# Altium project mycar_batchargepcb.PrjPcb
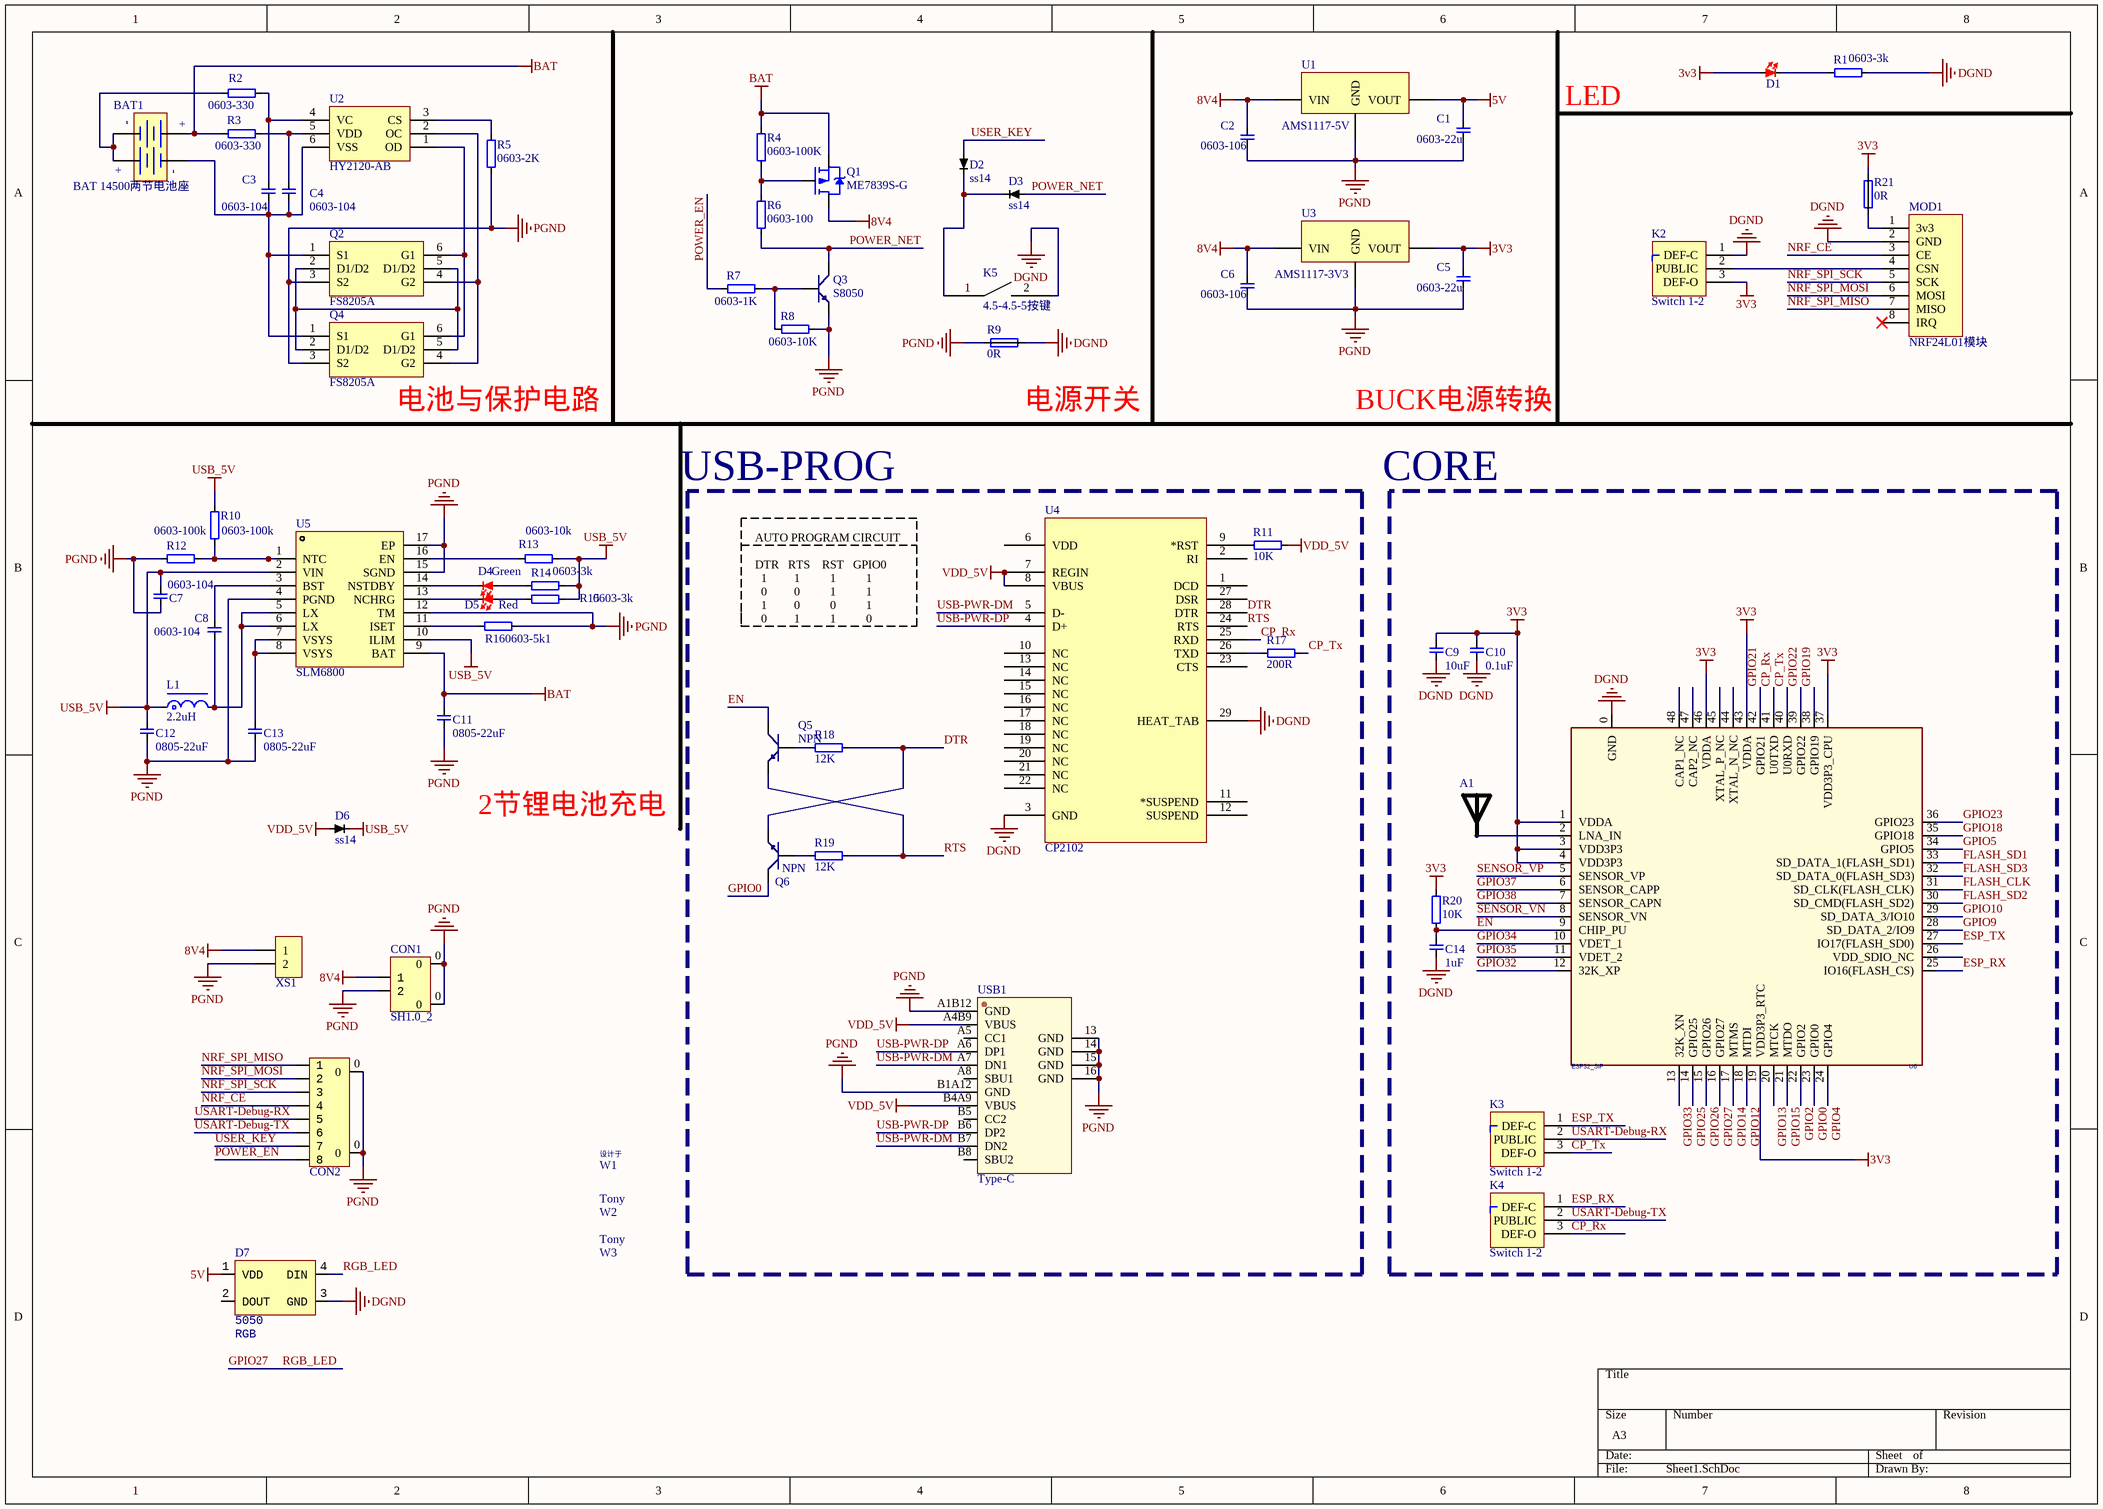
[diagram p0: Sheet1.SchDoc]
1 sheet, 69 parts. Net scope: global (net labels, ports and power ports of the same name join across sheets).
Board file: PCB1.PcbDoc

## Sheet Sheet1.SchDoc
size A3; SheetNumber: 1; SheetTotal: 1

### Parts
A1  RAINSUN  [ANT-Rainsun-AN5120]  (value not drawn)
BAT1  BAT 14500两节电池座  [BAT5#x2 电池座]
C1  0603-22u  [CAP_0603]
C2  0603-106  [CAP_0603]
C3  0603-104  [CAP_0603]
C4  0603-104  [CAP_0603]
C5  0603-22u  [CAP_0603]
C6  0603-106  [CAP_0603]
C7  0603-104  [CAP_0603]
C8  0603-104  [CAP_0603]
C9  10uF  [CAP_0603]
C10  0.1uF  [CAP_0603]
C11  0805-22uF  [CAP_0805]
C12  0805-22uF  [CAP_0805]
C13  0805-22uF  [CAP_0805]
C14  1uF  [CAP_0603]
CON1  SH1.0_2  [SH1.0 Vertical 2P]
CON2  FFC_0.5_8  [FFC_0.5_8]  (value not drawn)
D1  led  [led0603]  (value not drawn)
D2  ss14  [SOD-323]
D3  ss14  [SOD-323]
D4  Green  [led0603]
D5  Red  [led0603]
D6  ss14  [SOD-323]
D7  Type: 5050  [LED_5050_WS2812B]  (hidden comment: RGB)
K2  Switch 1-2  [Switch 1-2 0603]
K3  Switch 1-2  [Switch 1-2 0603]
K4  Switch 1-2  [Switch 1-2 0603]
K5  4.5-4.5-5按键  [4.5-4.5-5按键]
L1  2.2uH  [NR4012]
MOD1  NRF24L01模块  [NRF24L01模块-贴片]
Q1  ME7839S-G  [SOT23]
Q2  FS8205A  [SOT23-6]
Q3  S8050  [SOT23]
Q4  FS8205A  [SOT23-6]
Q5  NPN  [SOT23]
Q6  NPN  [SOT23]
R1  0603-3k  [RES_0603]
R2  0603-330  [RES_0603]
R3  0603-330  [RES_0603]
R4  0603-100K  [RES_0603]
R5  0603-2K  [RES_0603]
R6  0603-100  [RES_0603]
R7  0603-1K  [RES_0603]
R8  0603-10K  [RES_0603]
R9  0R  [RES_0805-SHORT]
R10  0603-100k  [RES_0603]
R11  10K  [RES_0603]
R12  0603-100k  [RES_0603]
R13  0603-10k  [RES_0603]
R14  0603-3k  [RES_0603]
R15  0603-3k  [RES_0603]
R16  0603-5k1  [RES_0603]
R17  200R  [RES_0603]
R18  12K  [RES_0603]
R19  12K  [RES_0603]
R20  10K  [RES_0603]
R21  0R  [RES_0603-SHORT]
U1  AMS1117-5V  [SOT223]
U2  HY2120-AB  [SOT23-6]
U3  AMS1117-3V3  [SOT223]
U4  CP2102  [QFN-28]
U5  SLM6800  [QFN-16_4x4]
U6  ESP32_SIP  [QFN-48_7X7]
USB1  Type-C  [TypeC-304-16BCP]
W1  设计于  [designed by（430-70）]  (value not drawn)
W2  Tony  [Tony_2(200-70)]  (value not drawn)
W3  Tony  [Tony_artist]  (value not drawn)
XS1  HDR-1X2  [15EDGVM-2P]  (value not drawn)

### Nets
3V3: C5.2 C9.2 C10.2 D1.1 K2.3(DEF-O) R20.2 R21.2 U3.2(VOUT) U6.1(VDDA) U6.3(VDD3P3) U6.4(VDD3P3) U6.19(VDD3P3_RTC) U6.37(VDD3P3_CPU) U6.43(VDDA) U6.46(VDDA)
5V: C1.2 D7.1(VDD) U1.2(VOUT)
8V4: C2.2 C6.2 CON1.1 Q1.3(D) U1.3(VIN) U3.3(VIN) XS1.1
BAT: BAT1.3(+) C11.2 Q1.2(S) R3.1 R4.2 U5.9(BAT)
DGND: C9.1 C10.1 C14.1 D7.3(GND) K2.1(DEF-C) K5.2 MOD1.2(GND) R1.2 R9.1 U4.3(GND) U4.29(HEAT_TAB) U6.0(GND)
PGND: C1.1 C2.1 C5.1 C6.1 C7.2 C11.1 C12.1 C13.1 CON1.0 CON1.2 CON2.0 Q2.3(S2) Q3.2(E) Q4.3(S2) R5.1 R8.1 R9.2 R12.2 R16.1 U1.1(GND) U3.1(GND) U5.4(PGND) U5.12(TM) U5.15(SGND) U5.17(EP) USB1.13(GND) USB1.14(GND) USB1.15(GND) USB1.16(GND) USB1.A1B12(GND) USB1.B1A12(GND) XS1.2
USB_5V: C7.1 C12.2 D6.2 L1.1 R10.2 R13.1 R14.1 R15.1 U5.2(VIN) U5.10(ILIM)
VDD_5V: D6.1 R11.1 U4.7(REGIN) U4.8(VBUS) USB1.A4B9(VBUS) USB1.B4A9(VBUS)
CP_Rx: K4.3(DEF-O) U4.25(RXD) U6.41(U0TXD)
CP_Tx: K3.3(DEF-O) R17.1 U6.40(U0RXD)
DTR: Q6.2(E) R18.1 U4.28(DTR)
EN: C14.2 Q5.3(C) R20.1 U6.9(CHIP_PU)
ESP_RX: K4.1(DEF-C) U6.25(IO16(FLASH_CS))
ESP_TX: K3.1(DEF-C) U6.27(IO17(FLASH_SD0))
FLASH_CLK: U6.31(SD_CLK(FLASH_CLK))
FLASH_SD1: U6.33(SD_DATA_1(FLASH_SD1))
FLASH_SD2: U6.30(SD_CMD(FLASH_SD2))
FLASH_SD3: U6.32(SD_DATA_0(FLASH_SD3))
GPIO0: Q6.3(C) U6.23(GPIO0)
GPIO2: U6.22(GPIO2)
GPIO4: U6.24(GPIO4)
GPIO5: U6.34(GPIO5)
GPIO9: U6.28(SD_DATA_2/IO9)
GPIO10: U6.29(SD_DATA_3/IO10)
GPIO12: U6.18(MTDI)
GPIO13: U6.20(MTCK)
GPIO14: U6.17(MTMS)
GPIO15: U6.21(MTDO)
GPIO18: U6.35(GPIO18)
GPIO19: U6.38(GPIO19)
GPIO21: U6.42(GPIO21)
GPIO22: U6.39(GPIO22)
GPIO23: U6.36(GPIO23)
GPIO25: U6.14(GPIO25)
GPIO26: U6.15(GPIO26)
GPIO27: D7.4(DIN) U6.16(GPIO27)  [also labelled RGB_LED]
GPIO32: U6.12(32K_XP)
GPIO33: U6.13(32K_XN)
GPIO34: U6.10(VDET_1)
GPIO35: U6.11(VDET_2)
GPIO37: U6.6(SENSOR_CAPP)
GPIO38: U6.7(SENSOR_CAPN)
NRF_CE: CON2.4 MOD1.3(CE)
NRF_SPI_MISO: CON2.1 MOD1.7(MISO)
NRF_SPI_MOSI: CON2.2 MOD1.6(MOSI)
NRF_SPI_SCK: CON2.3 MOD1.5(SCK)
POWER_EN: CON2.8 R7.2
POWER_NET: D3.1 Q3.3(C) R6.1
RTS: Q5.2(E) R19.1 U4.24(RTS)
SENSOR_VN: U6.8(SENSOR_VN)
SENSOR_VP: U6.5(SENSOR_VP)
USART-Debug-RX: CON2.5 K3.2(PUBLIC)
USART-Debug-TX: CON2.6 K4.2(PUBLIC)
USB-PWR-DM: U4.5(D-) USB1.A7(DN1) USB1.B7(DN2)
USB-PWR-DP: U4.4(D+) USB1.A6(DP1) USB1.B6(DP2)
USER_KEY: CON2.7 D2.1
NetA1_1: A1.1 U6.2(LNA_IN)
NetBAT1_1: BAT1.1(+) BAT1.4(-) R2.1
NetBAT1_2: BAT1.2(-) C3.1 C4.1 Q2.1(S1) Q4.1(S1) U2.6(VSS)
NetC3_2: C3.2 R2.2 U2.4(VC)
NetC4_2: C4.2 R3.2 U2.5(VDD)
NetC8_1: C8.1 L1.2 U5.5(LX) U5.6(LX)
NetC8_2: C8.2 U5.3(BST)
NetC13_2: C13.2 U5.7(VSYS) U5.8(VSYS)
NetD1_2: D1.2 R1.1
NetD2_2: D2.2 D3.2 K5.1
NetD4_1: D4.1 R14.2
NetD4_2: D4.2 U5.14(NSTDBY)
NetD5_1: D5.1 R15.2
NetD5_2: D5.2 U5.13(NCHRG)
NetK2_2: K2.2(PUBLIC) MOD1.4(CSN)
NetMOD1_1: MOD1.1(3v3) R21.1
NetQ1_1: Q1.1(G) R4.1 R6.2
NetQ2_2: Q2.2(D1/D2) Q2.5(D1/D2) Q4.2(D1/D2) Q4.5(D1/D2)
NetQ2_4: Q2.4(G2) Q4.4(G2) U2.2(OC)
NetQ2_6: Q2.6(G1) Q4.6(G1) U2.1(OD)
NetQ3_1: Q3.1(B) R7.1 R8.2
NetQ5_1: Q5.1(B) R18.2
NetQ6_1: Q6.1(B) R19.2
NetR5_2: R5.2 U2.3(CS)
NetR10_1: R10.1 R12.1 U5.1(NTC)
NetR11_2: R11.2 U4.9(*RST)
NetR13_2: R13.2 U5.16(EN)
NetR16_2: R16.2 U5.11(ISET)
NetR17_2: R17.2 U4.26(TXD)

Not connected (* = marked no-connect by the designer): D7 2(DOUT); MOD1 8(IRQ)*; U4 1(DCD) 2(RI) 6(VDD) 10(NC) 11(*SUSPEND) 12(SUSPEND) 13(NC) 14(NC) 15(NC) 16(NC) 17(NC) 18(NC) 19(NC) 20(NC) 21(NC) 22(NC) 23(CTS) 27(DSR); U6 26(VDD_SDIO_NC) 44(XTAL_N_NC) 45(XTAL_P_NC) 47(CAP2_NC) 48(CAP1_NC); USB1 A5(CC1) A8(SBU1) B5(CC2) B8(SBU2)

### Notes on the sheet
- LED
- (near Q4) 电池与保护电路
- (near R9) 电源开关
- BUCK电源转换
- USB-PROG
- CORE
- AUTO PROGRAM CIRCUIT
  DTR   RTS    RST   GPIO0
  1         1          1          1
  0         0          1          1
  1         0          0          1
  0         1          1          0
- 2节锂电池充电

### Library data of the parts
A1 = ANT-Rainsun-AP5120
BAT1 = BAT5#x2电池座
C1-C14 = cap
CON1 = SH1.0_2: SH1.0 座子
CON2 = FFC_0.5_8: FFC; System: Connector
D2 D3 D6 = Diode
D4 D5 = led
D7 = RGB_4WIC: LED; Value: RGB
K2-K4 = Switch 1-2: 单刀双掷1-2
L1 = INDUCTOR
MOD1 = NRF24L01模块: Telesky配套模块
Q1 = SI2333DS: P沟道MOSFIT
Q2 Q4 = FS8205A: 2个N沟道 6A功率mos
Q3 = NPN
R1-R8 R10-R20 = Res
R9 R21 = Res-SHORT
U1 U3 = AMS1117
U2 = HY2120
U4 = CP2102: USB转TTL; PART DESC: SINGLE-CHIP USB TO UART BRIDGE, QFN28, RoHS.; MFG #1: SILICON LABS; PART NUMBER: CP2102; Value: Value; RefDes: RefDes; Type: DEV
U5 = SLM6800: 双锂电池充电芯片
U6 = ESP32-PICO
USB1 = Type-C母口
XS1 = Header 2: 2P接插件; 版权归属: 源创客; BOM名称: 2P接插件; 学习资源: www.ooocke.com